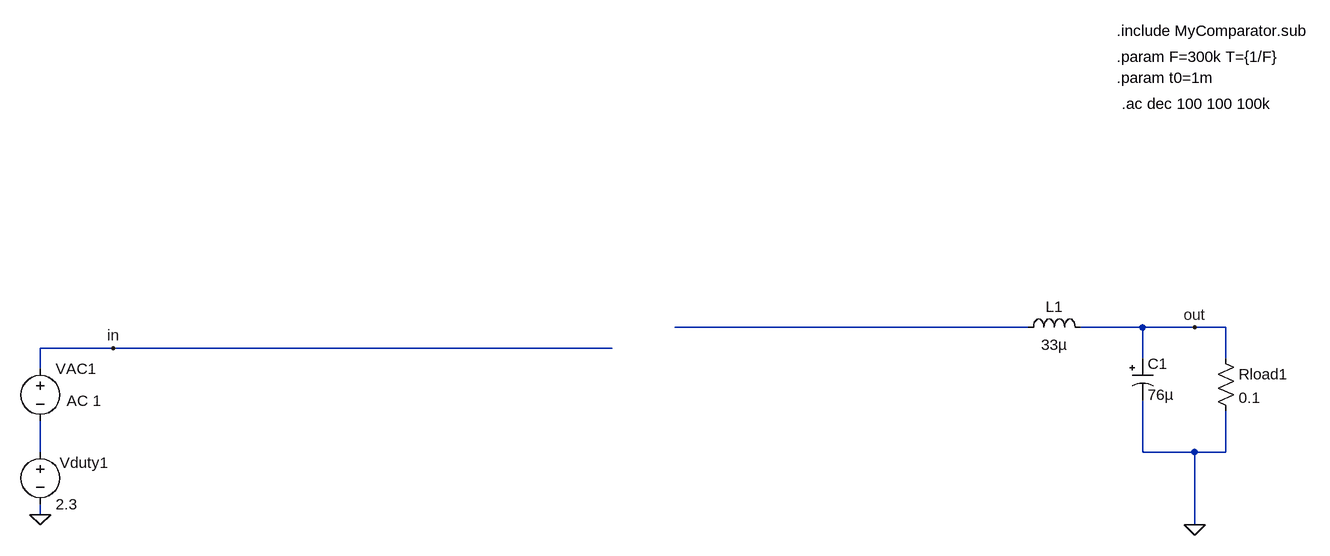
[diagram p0: schematic test.asc]
test.asc, the LTspice schematic file:
Version 4
SHEET 1 1784 680
WIRE 1328 208 784 208
WIRE 1504 208 1408 208
WIRE 1584 208 1504 208
WIRE 1632 208 1584 208
WIRE -80 240 -192 240
WIRE 688 240 -80 240
WIRE 1504 256 1504 208
WIRE 1632 256 1632 208
WIRE -192 272 -192 240
WIRE -192 400 -192 352
WIRE 1504 400 1504 320
WIRE 1584 400 1504 400
WIRE 1632 400 1632 336
WIRE 1632 400 1584 400
WIRE -192 496 -192 480
WIRE 1584 512 1584 400
FLAG 1584 512 0
FLAG -192 496 0
FLAG 1584 208 out
FLAG -80 240 in
SYMBOL res 1616 240 R0
SYMATTR InstName Rload1
SYMATTR Value 0.1
SYMBOL polcap 1488 256 R0
WINDOW 3 24 56 Left 2
SYMATTR Value 76µ
SYMATTR InstName C1
SYMATTR Description Capacitor
SYMATTR Type cap
SYMBOL voltage -192 384 R0
WINDOW 123 0 0 Left 0
WINDOW 39 0 0 Left 0
WINDOW 0 30 32 Left 2
SYMATTR InstName Vduty1
SYMATTR Value 2.3
SYMBOL voltage -192 256 R0
WINDOW 123 41 65 Left 2
WINDOW 39 0 0 Left 0
WINDOW 3 -108 112 Left 2
SYMATTR Value2 AC 1
SYMATTR InstName VAC1
SYMATTR Value ""
SYMBOL ind 1312 224 R270
WINDOW 0 32 56 VTop 2
WINDOW 3 5 56 VBottom 2
SYMATTR InstName L1
SYMATTR Value 33µ
TEXT 1464 -248 Left 2 !.include MyComparator.sub
TEXT 1464 -208 Left 2 !.param F=300k T={1/F}
TEXT 1464 -176 Left 2 !.param t0=1m
TEXT 1472 -136 Left 2 !.ac dec 100 100 100k

The netlist it stands for:
* test.asc
Rload1 out 0 0.1
C1 out 0 76µ
Vduty1 N002 0 2.3
VAC1 in N002 AC 1
L1 N001 out 33µ
.include MyComparator.sub
.param F=300k T={1/F}
.param t0=1m
.ac dec 100 100 100k
.backanno
.end